# Altium schematic sheet DSO_Control.SchDoc: Schematic_Name
size A4; CompanyName: University of Melbourne; Engineer: Your Name Here; DocumentNumber: 1; Revision: 0.1; SheetNumber: 1; SheetTotal: 1; Title_Project: Project_Title; StudentNo: Student No.
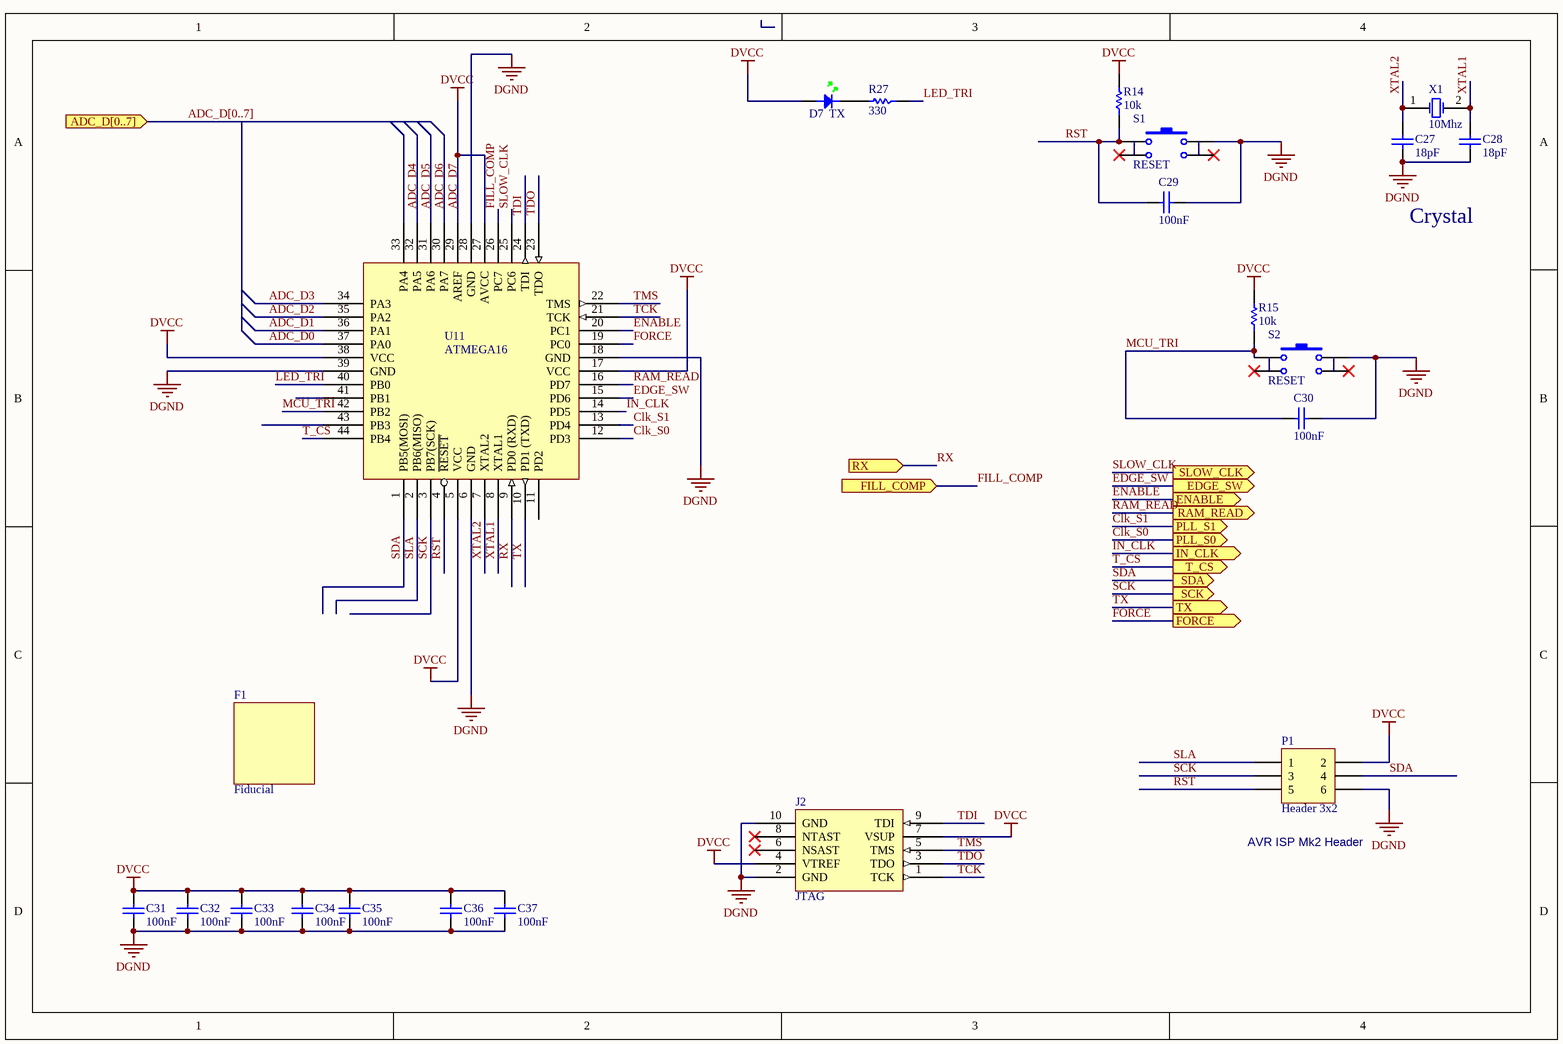
[diagram p0: DSO_Control.SchDoc]

## Parts
C27  18pF  [0805C]
C28  18pF  [0805C]
C29  100nF  [0805C]
C30  100nF  [0805C]
C31  100nF  [0805C]
C32  100nF  [0805C]
C33  100nF  [0805C]
C34  100nF  [0805C]
C35  100nF  [0805C]
C36  100nF  [0805C]
C37  100nF  [0805C]
D7  TX  [0805D-GREEN]
F1  Fiducial  [Fiducial]  (no BOM)
J2  JTAG  [BOXEDVERT10]
P1  Header 3x2  [HDR3x2]
R14  10k  [0805]
R15  10k  [0805]
R27  330  [0805]
S1  RESET  [SPST PB SWITCH SMD]
S2  RESET  [SPST PB SWITCH SMD]
U11  ATMEGA16  [QFP-48]
X1  10Mhz  [XTAL_FLAT_SMD]

## Ports
ADC_D[0..7] (in), EDGE_SW (out), ENABLE (out), FILL_COMP (in), FORCE (out), IN_CLK (out), PLL_S0 (out), PLL_S1 (out), RAM_READ (out), RX (in), SCK (out), SDA (out), SLOW_CLK (out), T_CS (out), TX (out)

## Nets
DGND: C27.2 C28.2 C29.2 C30.2 C31.2 C32.2 C33.2 C34.2 C35.2 C36.2 C37.2 J2.2(GND) J2.10(GND) P1.6 S1.2 S2.2 U11.6(GND) U11.18(GND) U11.28(GND) U11.39(GND)
DVCC: C31.1 C32.1 C33.1 C34.1 C35.1 C36.1 C37.1 D7.A J2.4(VTREF) J2.7(VSUP) P1.2 R14.2 R15.2 U11.5(VCC) U11.17(VCC) U11.27(AVCC) U11.29(AREF) U11.38(VCC)
ADC_D0: U11.37(PA0)
ADC_D1: U11.36(PA1)
ADC_D2: U11.35(PA2)
ADC_D3: U11.34(PA3)
ADC_D4: U11.33(PA4)
ADC_D5: U11.32(PA5)
ADC_D6: U11.31(PA6)
ADC_D7: U11.30(PA7)
Clk_S0: U11.12(PD3) ; port PLL_S0
Clk_S1: U11.13(PD4) ; port PLL_S1
EDGE_SW: U11.15(PD6) ; port EDGE_SW
ENABLE: U11.20(PC1) ; port ENABLE
FILL_COMP: U11.26(PC7) ; port FILL_COMP
FORCE: U11.19(PC0) ; port FORCE
IN_CLK: U11.14(PD5) ; port IN_CLK
LED_TRI: R27.1 U11.40(PB0)
MCU_TRI: C30.1 R15.1 S2.1 U11.42(PB2)
RAM_READ: U11.16(PD7) ; port RAM_READ
RST: C29.1 P1.5 R14.1 S1.1 U11.4(~{RESET})
RX: U11.9(PD0_(RXD)) ; port RX
SCK: P1.3 U11.3(PB7(SCK)) ; port SCK
SDA: P1.4 U11.1(PB5(MOSI)) ; port SDA
SLA: P1.1 U11.2(PB6(MISO))
SLOW_CLK: U11.25(PC6) ; port SLOW_CLK
T_CS: U11.44(PB4) ; port T_CS
TCK: J2.1(TCK) U11.21(TCK)
TDI: J2.9(TDI) U11.24(TDI)
TDO: J2.3(TDO) U11.23(TDO)
TMS: J2.5(TMS) U11.22(TMS)
TX: U11.10(PD1_(TXD)) ; port TX
XTAL1: C28.1 U11.8(XTAL1) X1.2(OSC2)
XTAL2: C27.1 U11.7(XTAL2) X1.1(OSC1)
NetD7_K: D7.K R27.2

Not connected (* = marked no-connect by the designer): J2 6(NSAST)* 8(NTAST)*; S1 3* 4*; S2 3* 4*; U11 11(PD2) 41(PB1) 43(PB3)

## Buses and harness runs
bus ADC_D[0..7] = port ADC_D[0..7]

## Notes on the sheet
- Crystal
- (near P1) AVR ISP Mk2 Header

## Library data of the parts
C27-C37 = C: Capacitor; Reviewed by: RM - 2018/08/05; Revision: July-2002: Re-released for DXP Platform.; Supplier 1: *; Supplier Part Number 1: *
  C27 C28: Value: 18pF
  C29-C37: Value: 100nF
D7 = LED GREEN: Light Emitting Diode; Reviewed by: RM - 2018/08/05; Revision: July-2002: Re-released for DXP Platform.; Supplier 1: Digi-Key; Supplier Part Number 1: 160-1423-1-ND
J2 = JTAG_CON: Reviewed by: RM - 2018/08/05; Supplier 1: Digi-Key; Supplier Part Number 1: OR896-ND
P1 = Header 3x2: Header, 5-Pin; Reviewed by: RM - 2018/08/05; Supplier 1: Digi-Key; Supplier Part Number 1: 952-2121-ND
R14 R15 R27 = R: Resistor; Reviewed by: RM - 2018/08/05; Supplier 1: *; Suppler Part Number 1: *
  R14 R15: Value: 10k
  R27: Value: 330
S1 S2 = SW_PB_1P1T4: Momentary Push Button Switch 1P 1T 2pins; Reviewed by: RM - 2018/08/05; Revision: July-2002: Re-released for DXP Platform.; Supplier 1: Digi-Key; Supplier Part Number 1: CKN9085CT-ND
U11 = ATMEGA16: ATMEGA16 Microcontroller; Reviewed by: RM - 2018/08/05; Supplier 1: Digi-Key; Supplier Part Number 1: ATMEGA16A-AU-ND
X1 = XTAL: Crystal Oscillator; Reviewed by: RM - 2018/08/05; Revision: July-2002: Re-released for DXP Platform.; Supplier 1: Digi-Key; Supplier Part Number 1: 887-1080-1-ND